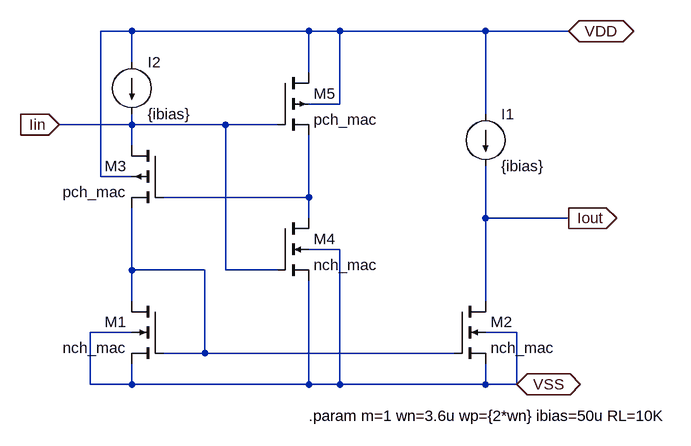
[diagram p0: schematic currentmirror_v1.asc]
currentmirror_v1.asc, the LTspice schematic file:
Version 4
SHEET 1 1268 680
WIRE 256 -256 208 -256
WIRE 528 -256 256 -256
WIRE 576 -256 528 -256
WIRE 800 -256 576 -256
WIRE 928 -256 800 -256
WIRE 256 -208 256 -256
WIRE 528 -192 528 -256
WIRE 576 -144 576 -256
WIRE 576 -144 528 -144
WIRE 800 -128 800 -256
WIRE 256 -112 256 -128
WIRE 256 -112 144 -112
WIRE 400 -112 256 -112
WIRE 480 -112 400 -112
WIRE 256 -80 256 -112
WIRE 208 -32 208 -256
WIRE 256 -32 208 -32
WIRE 528 0 528 -96
WIRE 528 0 304 0
WIRE 528 32 528 0
WIRE 800 32 800 -48
WIRE 928 32 800 32
WIRE 576 80 528 80
WIRE 256 112 256 16
WIRE 368 112 256 112
WIRE 400 112 400 -112
WIRE 480 112 400 112
WIRE 256 160 256 112
WIRE 800 160 800 32
WIRE 256 208 192 208
WIRE 848 208 800 208
WIRE 368 240 368 112
WIRE 368 240 304 240
WIRE 752 240 368 240
WIRE 192 288 192 208
WIRE 256 288 256 256
WIRE 256 288 192 288
WIRE 528 288 528 128
WIRE 528 288 256 288
WIRE 576 288 576 80
WIRE 576 288 528 288
WIRE 800 288 800 256
WIRE 800 288 576 288
WIRE 848 288 848 208
WIRE 848 288 800 288
FLAG 928 -256 VDD
IOPIN 928 -256 BiDir
FLAG 848 288 VSS
IOPIN 848 288 BiDir
FLAG 144 -112 Iin
IOPIN 144 -112 In
FLAG 928 32 Iout
IOPIN 928 32 Out
DATAFLAG 336 112 ""
DATAFLAG 368 0 ""
SYMBOL nmos4 752 160 R0
SYMATTR InstName M2
SYMATTR Value nch_mac
SYMATTR Value2 l=0.54u w={wn} m={m}
SYMBOL pmos4 304 -80 M0
SYMATTR InstName M3
SYMATTR Value pch_mac
SYMATTR Value2 l=180n w=36u m={m}
SYMBOL pmos4 480 -192 R0
SYMATTR InstName M5
SYMATTR Value pch_mac
SYMATTR Value2 l=180n w=10.8u m={m}
SYMBOL nmos4 304 160 M0
SYMATTR InstName M1
SYMATTR Value nch_mac
SYMATTR Value2 l=0.18u w={wn} m={m}
SYMBOL current 800 -128 R0
WINDOW 123 0 0 Left 0
WINDOW 39 0 0 Left 0
SYMATTR InstName I1
SYMATTR Value {ibias}
SYMBOL current 256 -208 R0
WINDOW 123 0 0 Left 0
WINDOW 39 0 0 Left 0
SYMATTR InstName I2
SYMATTR Value {ibias}
SYMBOL nmos4 480 32 R0
SYMATTR InstName M4
SYMATTR Value nch_mac
SYMATTR Value2 l=0.18u w=0.18u m={m}
TEXT 528 336 Left 2 !.param m=1 wn=3.6u wp={2*wn} ibias=50u RL=10K

The netlist it stands for:
* currentmirror_v1.asc
M2 Iout N002 VSS VSS nch_mac l=0.54u w={wn} m={m}
M3 Iin N001 N002 VDD pch_mac l=180n w=36u m={m}
M5 VDD Iin N001 VDD pch_mac l=180n w=10.8u m={m}
M1 N002 N002 VSS VSS nch_mac l=0.18u w={wn} m={m}
I1 VDD Iout {ibias}
I2 VDD Iin {ibias}
M4 N001 Iin VSS VSS nch_mac l=0.18u w=0.18u m={m}
.model NMOS NMOS
.model PMOS PMOS
.lib standard.mos
.param m=1 wn=3.6u wp={2*wn} ibias=50u RL=10K
.backanno
.end